# Altium schematic sheet Cover_Page.SchDoc
size A4
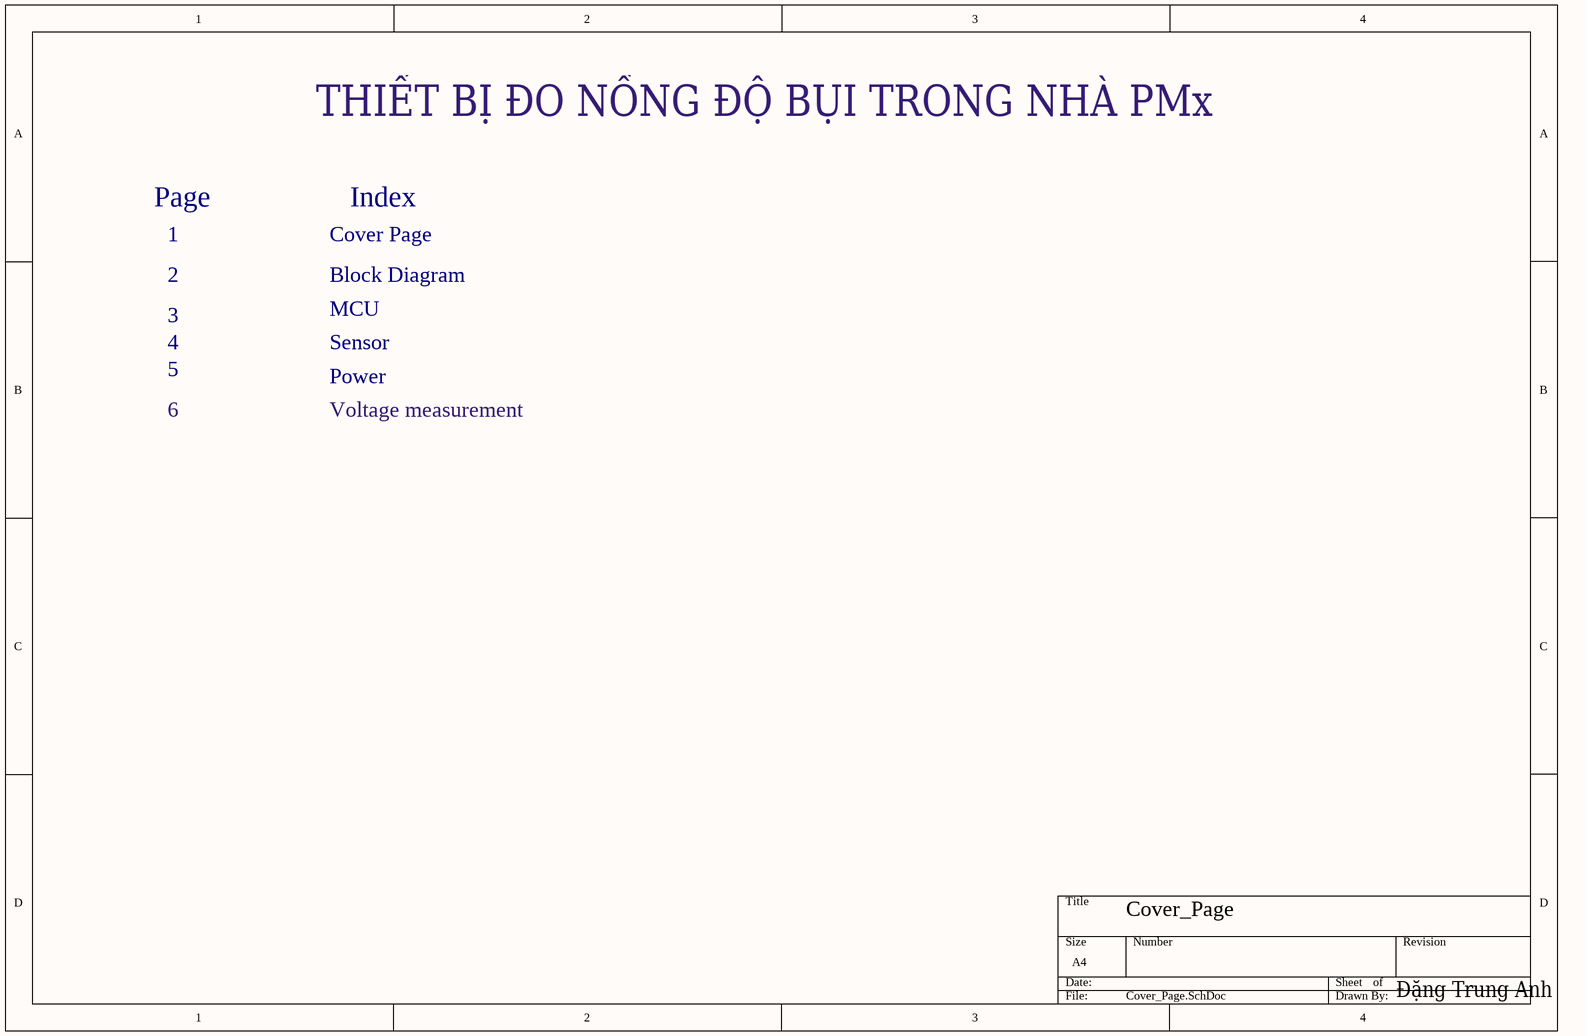
[diagram p0: Cover_Page.SchDoc]

## Notes on the sheet
- THIẾT BỊ ĐO NỒNG ĐỘ BỤI TRONG NHÀ PMx
- Page
- 1
- Cover Page
- Index
- 2
- Block Diagram
- 3
- 4
- 5
- MCU
- Sensor
- Power
- 6
- Voltage measurement
- Cover_Page
- Đặng Trung Anh